# Altium schematic sheet charge.SchDoc
size A4
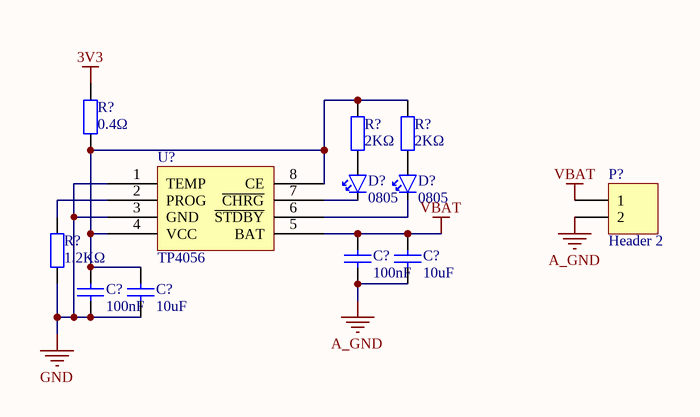
[diagram p0: charge.SchDoc]

## Parts
(Parts that share a designator on the sheet are numbered #1, #2 ... from top to bottom, then left to right.)
C?#1  100nF  [0603_C]
C?#2  10uF  [1206_C]
C?#3  100nF  [0603_C]
C?#4  10uF  [1206_C]
D?#1  0805  [0805-LED]
D?#2  0805  [0805-LED]
P?  Header 2  [HDR1X2]
R?#1  0.4Ω  [1206_R]
R?#2  2KΩ  [0603_R]
R?#3  2KΩ  [0603_R]
R?#4  1.2KΩ  [0603_R]
U?  TP4056  [SOP-8_EP_150mil]

## Nets
3V3: R?#1.2
A_GND: C?#1.1 C?#2.1 P?.2
GND: C?#3.1 C?#4.1 R?#4.1 U?.1(TEMP) U?.3(GND)
VBAT: C?#1.2 C?#2.2 P?.1 U?.5(BAT)
NetC?#3_2: C?#3.2 C?#4.2 R?#1.1 R?#2.1 R?#3.1 U?.4(VCC) U?.8(CE)
NetD?#1_1: D?#1.1 U?.7(~{CHRG})
NetD?#1_2: D?#1.2 R?#2.2
NetD?#2_1: D?#2.1 U?.6(~{STDBY})
NetD?#2_2: D?#2.2 R?#3.2
NetR?#4_2: R?#4.2 U?.2(PROG)

## Library data of the parts
C?#1 C?#3 = 0603 100nF (104) 10% 50V: 贴片电容; ComponentLink1Description: 供应商链接; ComponentLink1URL: http://www.szlcsc.com/product/details_15331.html; Package: 0603; Supplier: LC; SuppliersPartNumber: C14663
C?#2 C?#4 = 1206 10uF (106) 10% 50V: 贴片电容; ComponentLink1Description: 供应商链接; ComponentLink1URL: http://www.szlcsc.com/product/details_14236.html; Package: 1206; Supplier: LC; SuppliersPartNumber: C13585
D?#1 = LED0805: Red
D?#2 = LED0805: Green
P? = Header 2: Header, 2-Pin; LatestRevisionDate: 17-Jul-2002; LatestRevisionNote: Re-released for DXP Platform.; Publisher: Altium Limited
R?#1 = 1206 0.1Ω (R100) 1%: 贴片电阻; ComponentLink1Description: 供应商链接; ComponentLink1URL: http://www.szlcsc.com/product/details_26077.html; Package: 1206; Supplier: LC; SuppliersPartNumber: C25334
R?#2-R?#4 = 0603 10KΩ (1002) 1%: 贴片电阻; ComponentLink1Description: 供应商链接; ComponentLink1URL: http://www.szlcsc.com/product/details_26547.html; Package: 0603; Supplier: LC; SuppliersPartNumber: C25804
U? = TP4056_[C16581]: 电池电源管理; ComponentLink1Description: 供应商链接; ComponentLink1URL: http://www.szlcsc.com/product/details_17264.html; Package: SOP-8_EP_150mil; Supplier: LC; SuppliersPartNumber: C16581